# Altium schematic sheet Sheet2.SchDoc: Ignitors_Actuators
size A; Revision: 1.1; SheetNumber: 2; SheetTotal: 2
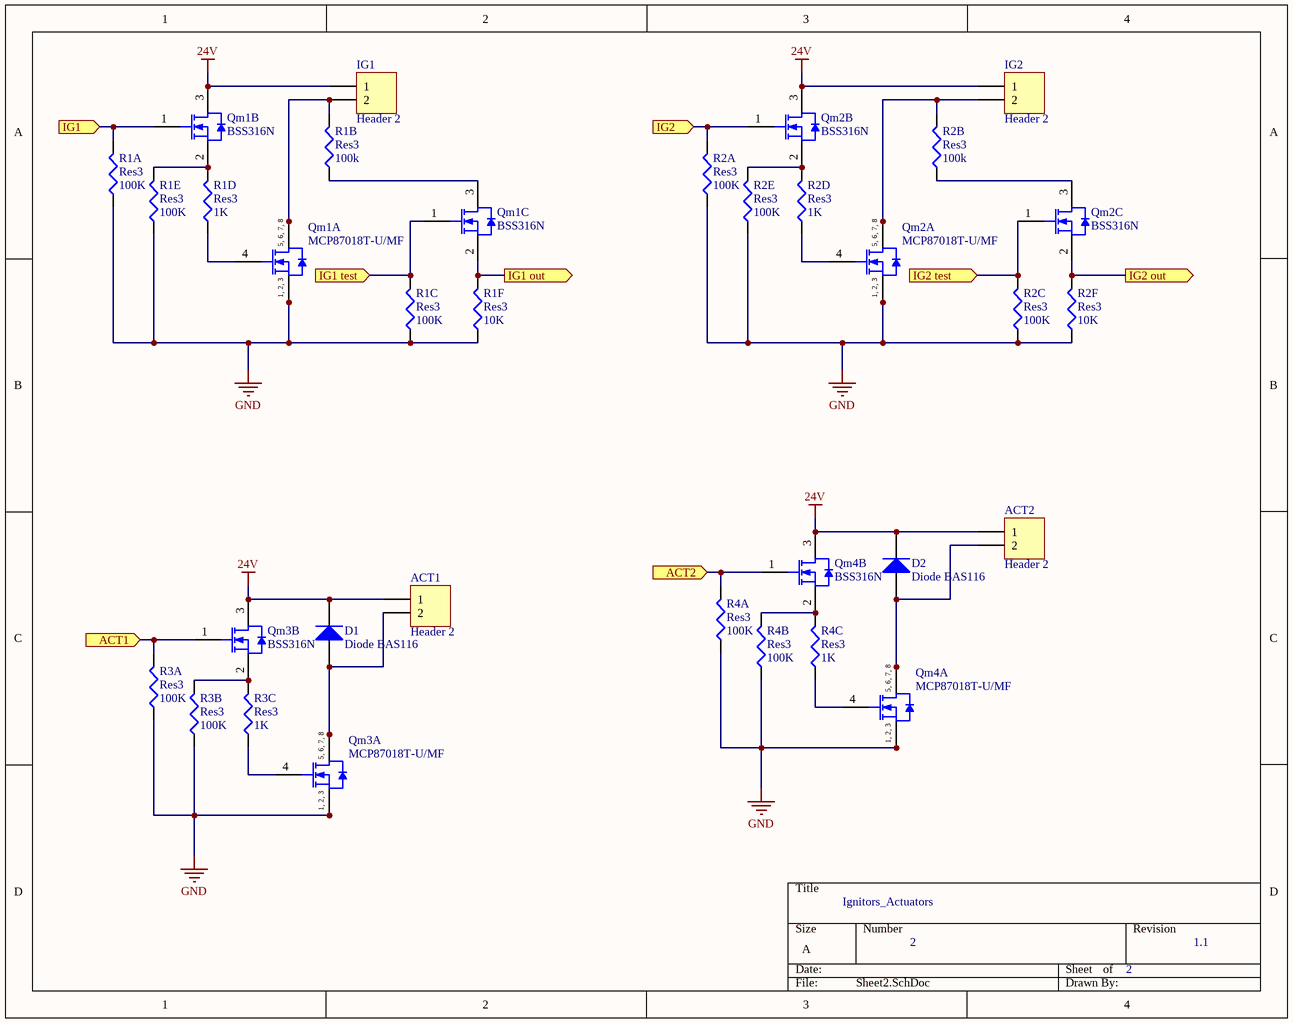
[diagram p0: Sheet2.SchDoc]

## Parts
ACT1  Header 2  [HDR1X2]
ACT2  Header 2  [HDR1X2]
D1  Diode BAS116  [SOT-23_N]
D2  Diode BAS116  [SOT-23_N]
IG1  Header 2  [HDR1X2]
IG2  Header 2  [HDR1X2]
Qm1A  MCP87018T-U/MF  [MCHP-PDFN-MF8_V]
Qm1B  BSS316N  [INF-PG-SOT23_N]
Qm1C  BSS316N  [INF-PG-SOT23_N]
Qm2A  MCP87018T-U/MF  [MCHP-PDFN-MF8_V]
Qm2B  BSS316N  [INF-PG-SOT23_N]
Qm2C  BSS316N  [INF-PG-SOT23_N]
Qm3A  MCP87018T-U/MF  [MCHP-PDFN-MF8_V]
Qm3B  BSS316N  [INF-PG-SOT23_N]
Qm4A  MCP87018T-U/MF  [MCHP-PDFN-MF8_V]
Qm4B  BSS316N  [INF-PG-SOT23_N]
R1A  Res3  value 100K  [J1-0603]
R1B  Res3  value 100k  [J1-0603]
R1C  Res3  value 100K  [J1-0603]
R1D  Res3  value 1K  [J1-0603]
R1E  Res3  value 100K  [J1-0603]
R1F  Res3  value 10K  [J1-0603]
R2A  Res3  value 100K  [J1-0603]
R2B  Res3  value 100k  [J1-0603]
R2C  Res3  value 100K  [J1-0603]
R2D  Res3  value 1K  [J1-0603]
R2E  Res3  value 100K  [J1-0603]
R2F  Res3  value 10K  [J1-0603]
R3A  Res3  value 100K  [J1-0603]
R3B  Res3  value 100K  [J1-0603]
R3C  Res3  value 1K  [J1-0603]
R4A  Res3  value 100K  [J1-0603]
R4B  Res3  value 100K  [J1-0603]
R4C  Res3  value 1K  [J1-0603]

## Ports
ACT1 (in), ACT2 (in), IG1 (in), IG1 out (out), IG1 test (in), IG2 (in), IG2 out (out), IG2 test (in)

## Nets
24V: ACT1.1 ACT2.1 D1.3(K) D2.3(K) IG1.1 IG2.1 Qm1B.3(DRAIN) Qm2B.3(DRAIN) Qm3B.3(DRAIN) Qm4B.3(DRAIN)
GND: Qm1A.1(S) Qm1A.2(S) Qm1A.3(S) Qm2A.1(S) Qm2A.2(S) Qm2A.3(S) Qm3A.1(S) Qm3A.2(S) Qm3A.3(S) Qm4A.1(S) Qm4A.2(S) Qm4A.3(S) R1A.1 R1C.1 R1E.1 R1F.1 R2A.1 R2C.1 R2E.1 R2F.1 R3A.1 R3B.1 R4A.1 R4B.1
ACT1: Qm3B.1(GATE) R3A.2 ; port ACT1
ACT2: Qm4B.1(GATE) R4A.2 ; port ACT2
IG1: Qm1B.1(GATE) R1A.2 ; port IG1
IG1 out: Qm1C.2(SOURCE) R1F.2 ; port IG1 out
IG1 test: Qm1C.1(GATE) R1C.2 ; port IG1 test
IG2: Qm2B.1(GATE) R2A.2 ; port IG2
IG2 out: Qm2C.2(SOURCE) R2F.2 ; port IG2 out
IG2 test: Qm2C.1(GATE) R2C.2 ; port IG2 test
NetACT1_2: ACT1.2 D1.1(A) Qm3A.5(D) Qm3A.6(D) Qm3A.7(D) Qm3A.8(D)
NetACT2_2: ACT2.2 D2.1(A) Qm4A.5(D) Qm4A.6(D) Qm4A.7(D) Qm4A.8(D)
NetIG1_2: IG1.2 Qm1A.5(D) Qm1A.6(D) Qm1A.7(D) Qm1A.8(D) R1B.2
NetIG2_2: IG2.2 Qm2A.5(D) Qm2A.6(D) Qm2A.7(D) Qm2A.8(D) R2B.2
NetQm1A_4: Qm1A.4(G) R1D.1
NetQm1B_2: Qm1B.2(SOURCE) R1D.2 R1E.2
NetQm1C_3: Qm1C.3(DRAIN) R1B.1
NetQm2A_4: Qm2A.4(G) R2D.1
NetQm2B_2: Qm2B.2(SOURCE) R2D.2 R2E.2
NetQm2C_3: Qm2C.3(DRAIN) R2B.1
NetQm3A_4: Qm3A.4(G) R3C.1
NetQm3B_2: Qm3B.2(SOURCE) R3B.2 R3C.2
NetQm4A_4: Qm4A.4(G) R4C.1
NetQm4B_2: Qm4B.2(SOURCE) R4B.2 R4C.2

## Notes on the sheet
- (in symbol MCP87018T-U/MF) 5, 6, 7, 8; 1, 2, 3

## Library data of the parts
ACT1 ACT2 IG1 IG2 = Header 2: Header, 2-Pin; LatestRevisionDate: 17-Jul-2002; LatestRevisionNote: Re-released for DXP Platform.; Publisher: Altium Limited
D1 D2 = Diode BAS116: Silicon Low Leakage Diode; Note: Pin 2 is not connected and not drawn.; Published: 21-Mar-2003; LatestRevisionDate: 29-May-2009; LatestRevisionNote: IPC-7351 Footprint Added.; DatasheetVersion: Oct-1999; PackageVersion: Sep-2001; PackageReference: SOT-23; Publisher: Altium Limited; PackageDescription: 3-Pin SOT-23 Package 0.95 mm Pitch, 2.5 mm Lead Span; ComponentLink1Description: Manufacturer Link; ComponentLink1URL: http://www.infineon.com/; ComponentLink2Description: Datasheet; ComponentLink2URL: http://www.infineon.com/upload/Document/cmc_upload/documents/080/656/bas116series.pdf
Qm1A Qm2A Qm3A Qm4A = MCP87018T-U/MF: High-Speed N-Channel Power MOSFET, Single Configuration, 25 V, -55 to 150 degC, 8-pin PDFN (MF8), Tape and Reel; Manufacturer: Microchip; DatasheetVersion: Rev. A; PackageVersion: C04-188B; PackageReference: PDFN-MF8; PackageDescription: 8-Lead Power Dual Flatpack No Lead Package, 5 x 6 mm Body, 1.27 mm Pitch; Supplier 1: Digi-Key; Supplier Part Number 1: MCP87018T-U/MF-ND; Supplier 2: Newark; Supplier Part Number 2: 53W9402; Supplier 3: Mouser; Supplier Part Number 3: 579-MCP87018T-U/MF; Mounting Technology: Surface Mount; PartNumber: MCP87018T-U/MF; ComponentLink1Description: Manufacturer URL; ComponentLink1URL: http://www.microchip.com; ComponentLink2Description: Datasheet; ComponentLink2URL: http://ww1.microchip.com/downloads/en/DeviceDoc/22329A.pdf; ComponentLink3Description: Package Specification; ComponentLink3URL: http://www.microchip.com/stellent/groups/techpub_sg/documents/packagingspec/en012702.pdf; ComponentLink4Description: Product URL; ComponentLink4URL: http://www.microchip.com/MCP87018
Qm1B Qm1C Qm2B Qm2C Qm3B Qm4B = BSS316N: N-Channel OptiMOS 2 Small-Signal-Transistor, 30 V VDS, 1.4 A ID, -55 to 150 degC, PG-SOT23, Reel, Green; Manufacturer: Infineon; Green: TRUE; ID (max): 1.4 A; IDpuls (max): 5.6 A; Ptot (max): 0.5 W; QG: 0.6 nC; RDS (on) (max): 160 mOhm; RDS (on) (max) (@4.5V): 280 mOhm; RthJA (max): 250 K/W; VDS (max): 30 V; VGS(th) (max): 2 V; VGS(th) (min): 1.2 V; DatasheetVersion: Rev. 2.3; PackageVersion: Apr-08; PackageReference: PG-SOT23; PackageDescription: 3-Pin Small Outline Transistor Package, 2.9 x 1.3 mm Body, 0.95 mm Pitch; Halogen-free: TRUE; Packing: Reel; Mounting Technology: Surface Mount; PartNumber: BSS316N; ComponentLink1Description: Manufacturer URL; ComponentLink1URL: http://www.infineon.com/; ComponentLink2Description: Datasheet; ComponentLink2URL: http://www.infineon.com/dgdl/BSS316N_Rev2.3.pdf?folderId=db3a3043156fd573011622e10b5c1f67&fileId=db3a304330f686060130ff7ee4b07f16; ComponentLink3Description: Package Specification; ComponentLink3URL: http://www.infineon.com/dgdl/SOT23-Package_Overview.pdf?folderId=db3a30431936bc4b0119532290053c66&fileId=db3a30431936bc4b0119533468123c85
R1A R1B R1C R1D R1E R1F R2A R2B R2C R2D R2E R2F R3A R3B R3C R4A R4B R4C = Res3: Resistor; Published: 8-Jun-2000; LatestRevisionDate: 29-May-2009; LatestRevisionNote: IPC-7351 Footprint Added.; PackageReference: J1-0603; Publisher: Altium Limited; PackageDescription: Chip Resistor